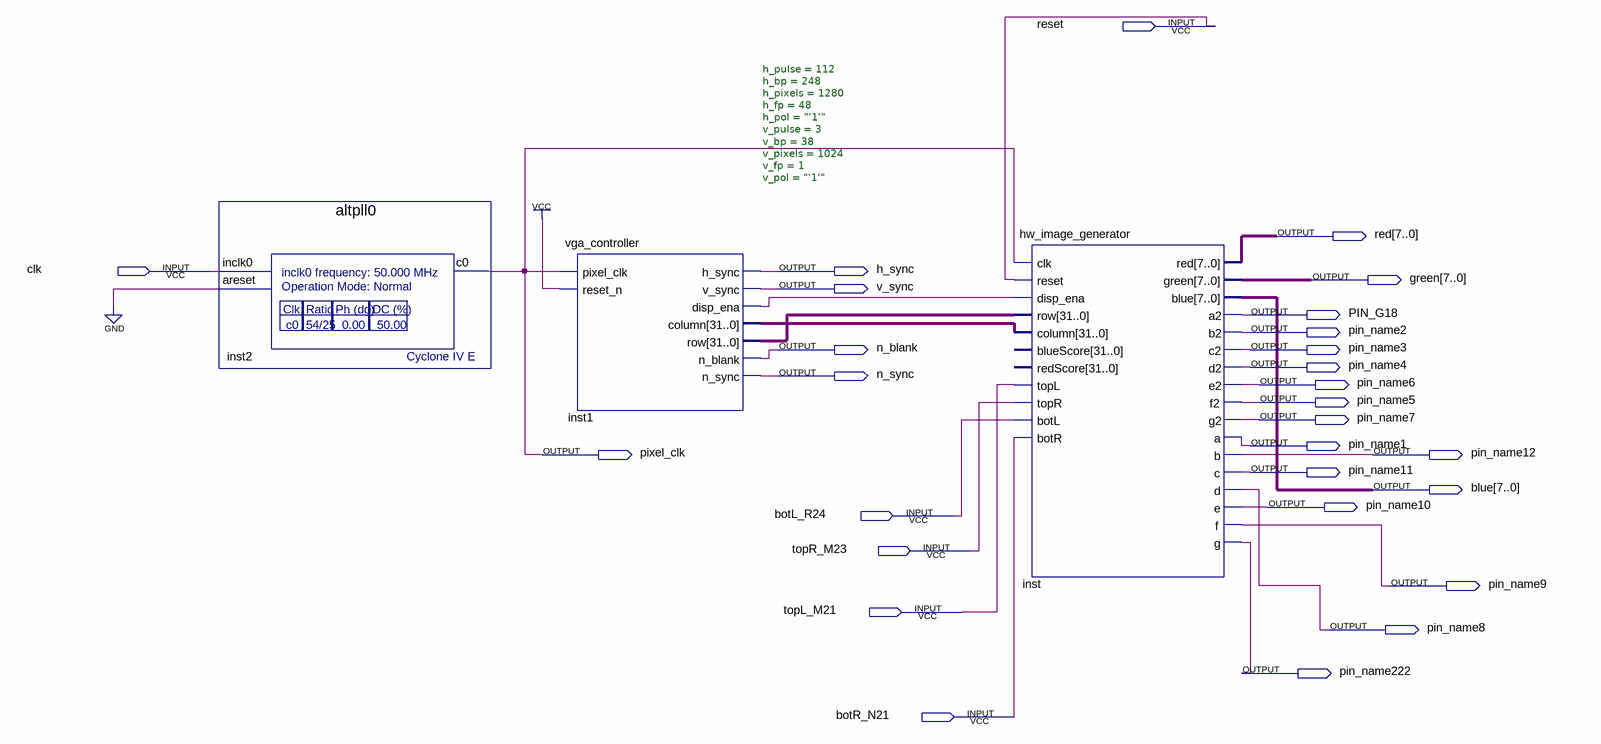
[diagram p0: schematic sheet]
// Quartus schematic vga_with_hw_test_image.bdf as structural Verilog: 3 symbols, 28 pins
module vga_with_hw_test_image (
  input  reset,
  input  clk,
  input  botL_R24,
  input  topR_M23,
  input  topL_M21,
  input  botR_N21,
  output [7:0] red,
  output h_sync,
  output [7:0] green,
  output v_sync,
  output PIN_G18,
  output pin_name2,
  output n_blank,
  output pin_name3,
  output pin_name4,
  output n_sync,
  output pin_name6,
  output pin_name5,
  output pin_name7,
  output pin_name1,
  output pixel_clk,
  output pin_name12,
  output pin_name11,
  output [7:0] blue,
  output pin_name10,
  output pin_name9,
  output pin_name8,
  output pin_name222
);

  wire inst1_disp_ena;
  wire [31:0] inst1_column, inst1_row;

  altpll0 inst2 (.inclk0(clk), .areset(1'b0), .c0(pixel_clk));
  vga_controller #(.h_pulse(112), .h_bp(248), .h_pixels(1280), .h_fp(48), .h_pol("'1'"), .v_pulse(3), .v_bp(38), .v_pixels(1024), .v_fp(1), .v_pol("'1'")) inst1 (
    .pixel_clk(pixel_clk), .reset_n(1'b1), .h_sync(h_sync), .v_sync(v_sync), .disp_ena(inst1_disp_ena),
    .column(inst1_column), .row(inst1_row), .n_blank(n_blank), .n_sync(n_sync));
  hw_image_generator inst (
    .clk(pixel_clk), .reset(reset), .disp_ena(inst1_disp_ena), .row(inst1_row), .column(inst1_column),
    .topL(topL_M21), .topR(topR_M23), .botL(botL_R24), .botR(botR_N21), .red(red), .green(green),
    .blue(blue), .a2(PIN_G18), .b2(pin_name2), .c2(pin_name3), .d2(pin_name4), .e2(pin_name6),
    .f2(pin_name5), .g2(pin_name7), .a(pin_name1), .b(pin_name12), .c(pin_name11), .d(pin_name8),
    .e(pin_name10), .f(pin_name9), .g(pin_name222));  // open: blueScore, redScore
endmodule
